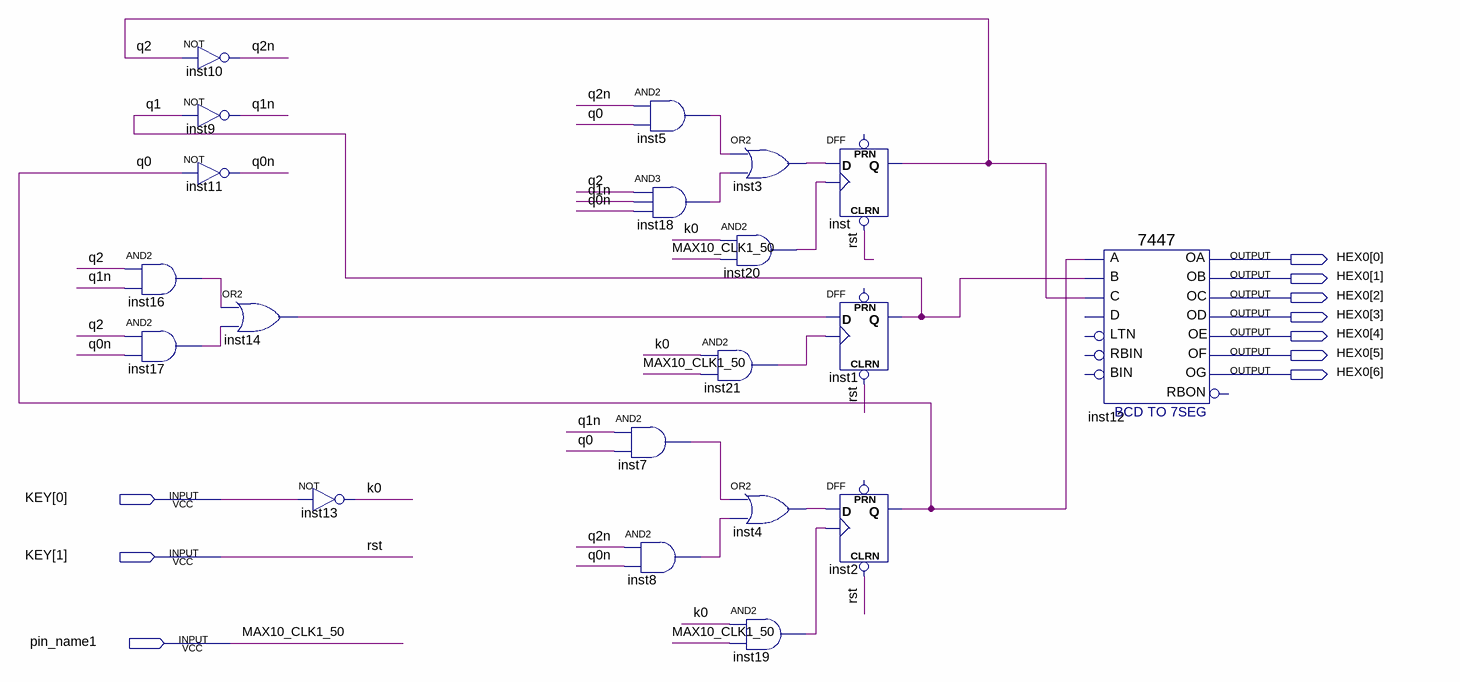
[diagram p0: schematic sheet]
// Quartus schematic eec18lab5.bdf as structural Verilog: 20 symbols, 10 pins
module eec18lab5 (
  input  [1:0] KEY,
  input  pin_name1,
  output [6:0] HEX0
);

  wire inst3_out, inst4_out, inst5_out, inst7_out, inst8_out, inst14_out, inst16_out, inst17_out, inst18_out,
       inst19_out, inst20_out, inst21_out, k0, q0, q0n, q1, q1n, q2, q2n;

  and inst16 (inst16_out, q2, q1n);
  and inst17 (inst17_out, q2, q0n);
  not inst10 (q2n, q2);
  not inst9 (q1n, q1);
  not inst11 (q0n, q0);
  or inst14 (inst14_out, inst16_out, inst17_out);
  not inst13 (k0, KEY[0]);
  and inst5 (inst5_out, q2n, q0);
  and inst18 (inst18_out, q2, q1n, q0n);
  and inst7 (inst7_out, q1n, q0);
  and inst8 (inst8_out, q2n, q0n);
  and inst21 (inst21_out, k0, pin_name1);
  or inst3 (inst3_out, inst5_out, inst18_out);
  and inst20 (inst20_out, k0, pin_name1);
  or inst4 (inst4_out, inst7_out, inst8_out);
  and inst19 (inst19_out, k0, pin_name1);
  DFF inst (.CLRN(KEY[1]), .CLK(inst20_out), .D(inst3_out), .Q(q2));  // open: PRN
  DFF inst1 (.CLRN(KEY[1]), .CLK(inst21_out), .D(inst14_out), .Q(q1));  // open: PRN
  DFF inst2 (.CLRN(KEY[1]), .CLK(inst19_out), .D(inst4_out), .Q(q0));  // open: PRN
  \7447  inst12 (
    .B(q1), .C(q2), .A(q0), .OB(HEX0[1]), .OC(HEX0[2]), .OE(HEX0[4]), .OD(HEX0[3]), .OF(HEX0[5]),
    .OG(HEX0[6]), .OA(HEX0[0]));  // open: LTN, D, RBIN, BIN, RBON

  // Other names for the same wires on the sheet: MAX10_CLK1_50 = pin_name1; rst = KEY[1]
endmodule
